# Altium schematic sheet PERIPHERAL.SchDoc: PERIPHERAL
size A3; Author: DODANHLUONG; Revision: 1.0; SheetNumber: 6; SheetTotal: 6; ProjectTitle: DSP_VERSION_1.0
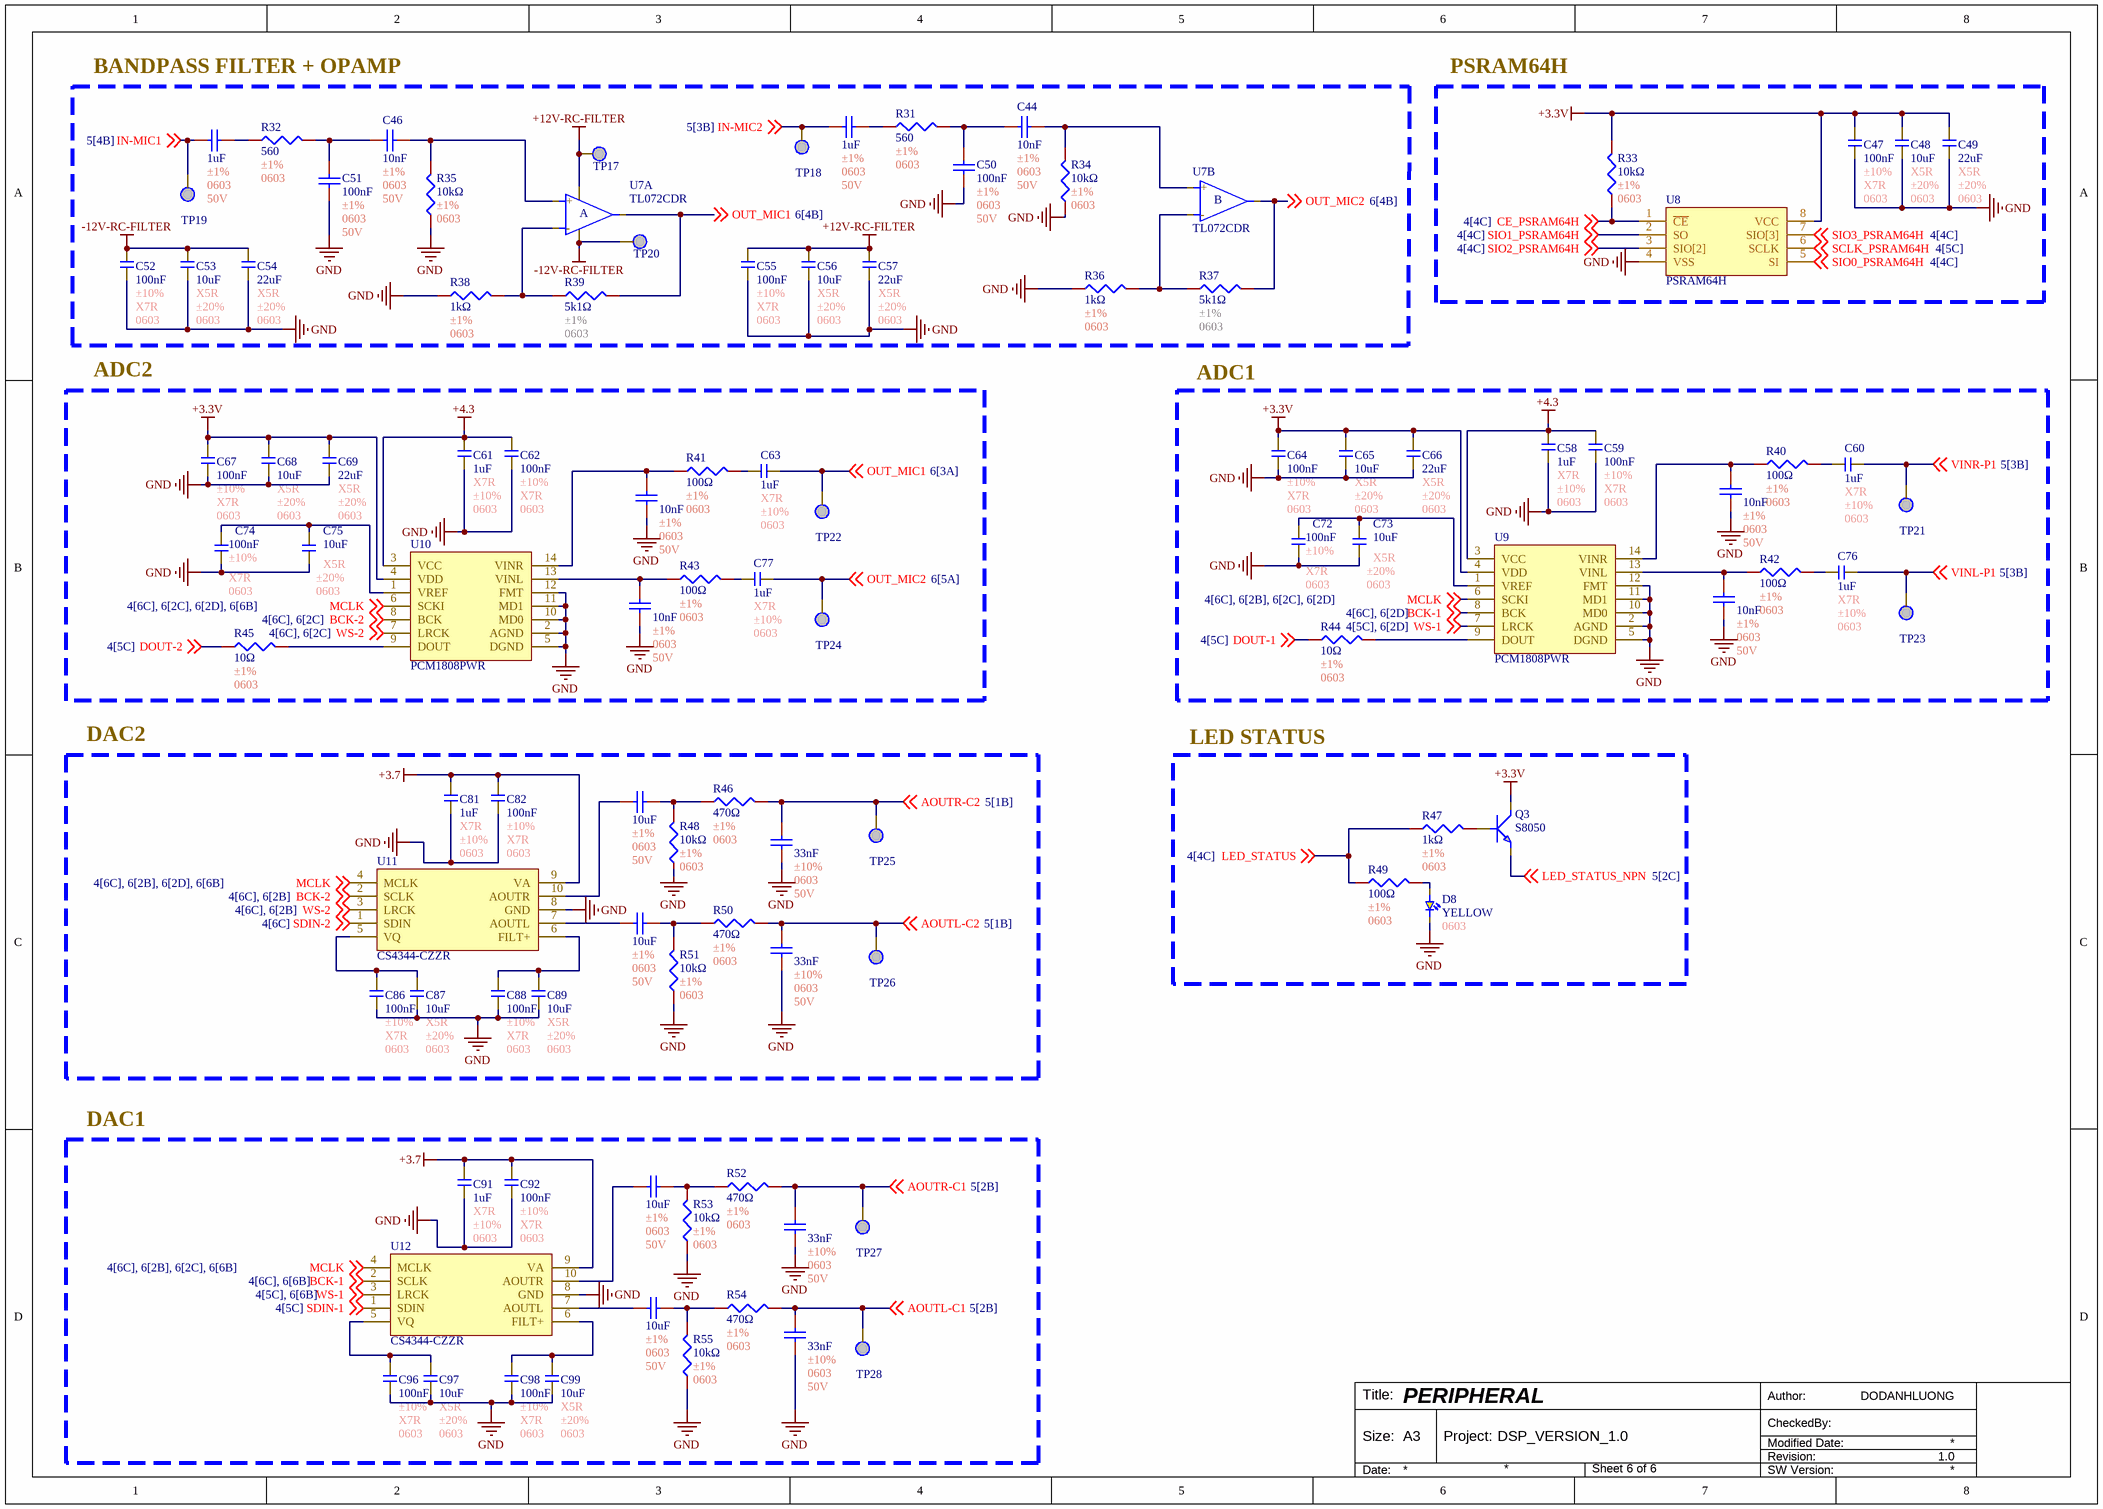
[diagram p0: PERIPHERAL.SchDoc]

## Parts
C43  1uF  Tolerance: ±1%  Package: 0603  Voltage Rating: 50V  [C0603]
C44  10nF  Tolerance: ±1%  Package: 0603  Voltage Rating: 50V  [C0603]
C45  1uF  Tolerance: ±1%  Package: 0603  Voltage Rating: 50V  [C0603]
C46  10nF  Tolerance: ±1%  Package: 0603  Voltage Rating: 50V  [C0603]
C47  100nF  Tolerance: ±10%  Temperature Coefficient: X7R  Package: 0603  [C0603]
C48  10uF  Temperature Coefficient: X5R  Tolerance: ±20%  Package: 0603  [C0603]
C49  22uF  Temperature Coefficient: X5R  Tolerance: ±20%  Package: 0603  [C0603]
C50  100nF  Tolerance: ±1%  Package: 0603  Voltage Rating: 50V  [C0603]
C51  100nF  Tolerance: ±1%  Package: 0603  Voltage Rating: 50V  [C0603]
C52  100nF  Tolerance: ±10%  Temperature Coefficient: X7R  Package: 0603  [C0603]
C53  10uF  Temperature Coefficient: X5R  Tolerance: ±20%  Package: 0603  [C0603]
C54  22uF  Temperature Coefficient: X5R  Tolerance: ±20%  Package: 0603  [C0603]
C55  100nF  Tolerance: ±10%  Temperature Coefficient: X7R  Package: 0603  [C0603]
C56  10uF  Temperature Coefficient: X5R  Tolerance: ±20%  Package: 0603  [C0603]
C57  22uF  Temperature Coefficient: X5R  Tolerance: ±20%  Package: 0603  [C0603]
C58  1uF  Temperature Coefficient: X7R  Tolerance: ±10%  Package: 0603  [C0603]
C59  100nF  Tolerance: ±10%  Temperature Coefficient: X7R  Package: 0603  [C0603]
C60  1uF  Temperature Coefficient: X7R  Tolerance: ±10%  Package: 0603  [C0603]
C61  1uF  Temperature Coefficient: X7R  Tolerance: ±10%  Package: 0603  [C0603]
C62  100nF  Tolerance: ±10%  Temperature Coefficient: X7R  Package: 0603  [C0603]
C63  1uF  Temperature Coefficient: X7R  Tolerance: ±10%  Package: 0603  [C0603]
C64  100nF  Tolerance: ±10%  Temperature Coefficient: X7R  Package: 0603  [C0603]
C65  10uF  Temperature Coefficient: X5R  Tolerance: ±20%  Package: 0603  [C0603]
C66  22uF  Temperature Coefficient: X5R  Tolerance: ±20%  Package: 0603  [C0603]
C67  100nF  Tolerance: ±10%  Temperature Coefficient: X7R  Package: 0603  [C0603]
C68  10uF  Temperature Coefficient: X5R  Tolerance: ±20%  Package: 0603  [C0603]
C69  22uF  Temperature Coefficient: X5R  Tolerance: ±20%  Package: 0603  [C0603]
C70  10nF  Tolerance: ±1%  Package: 0603  Voltage Rating: 50V  [C0603]
C71  10nF  Tolerance: ±1%  Package: 0603  Voltage Rating: 50V  [C0603]
C72  100nF  Tolerance: ±10%  Temperature Coefficient: X7R  Package: 0603  [C0603]
C73  10uF  Temperature Coefficient: X5R  Tolerance: ±20%  Package: 0603  [C0603]
C74  100nF  Tolerance: ±10%  Temperature Coefficient: X7R  Package: 0603  [C0603]
C75  10uF  Temperature Coefficient: X5R  Tolerance: ±20%  Package: 0603  [C0603]
C76  1uF  Temperature Coefficient: X7R  Tolerance: ±10%  Package: 0603  [C0603]
C77  1uF  Temperature Coefficient: X7R  Tolerance: ±10%  Package: 0603  [C0603]
C78  10nF  Tolerance: ±1%  Package: 0603  Voltage Rating: 50V  [C0603]
C79  10nF  Tolerance: ±1%  Package: 0603  Voltage Rating: 50V  [C0603]
C80  10uF  Tolerance: ±1%  Package: 0603  Voltage Rating: 50V  [C0603]
C81  1uF  Temperature Coefficient: X7R  Tolerance: ±10%  Package: 0603  [C0603]
C82  100nF  Tolerance: ±10%  Temperature Coefficient: X7R  Package: 0603  [C0603]
C83  33nF  Tolerance: ±10%  Package: 0603  Voltage Rating: 50V  [C0603]
C84  10uF  Tolerance: ±1%  Package: 0603  Voltage Rating: 50V  [C0603]
C85  33nF  Tolerance: ±10%  Package: 0603  Voltage Rating: 50V  [C0603]
C86  100nF  Tolerance: ±10%  Temperature Coefficient: X7R  Package: 0603  [C0603]
C87  10uF  Temperature Coefficient: X5R  Tolerance: ±20%  Package: 0603  [C0603]
C88  100nF  Tolerance: ±10%  Temperature Coefficient: X7R  Package: 0603  [C0603]
C89  10uF  Temperature Coefficient: X5R  Tolerance: ±20%  Package: 0603  [C0603]
C90  10uF  Tolerance: ±1%  Package: 0603  Voltage Rating: 50V  [C0603]
C91  1uF  Temperature Coefficient: X7R  Tolerance: ±10%  Package: 0603  [C0603]
C92  100nF  Tolerance: ±10%  Temperature Coefficient: X7R  Package: 0603  [C0603]
C93  33nF  Tolerance: ±10%  Package: 0603  Voltage Rating: 50V  [C0603]
C94  10uF  Tolerance: ±1%  Package: 0603  Voltage Rating: 50V  [C0603]
C95  33nF  Tolerance: ±10%  Package: 0603  Voltage Rating: 50V  [C0603]
C96  100nF  Tolerance: ±10%  Temperature Coefficient: X7R  Package: 0603  [C0603]
C97  10uF  Temperature Coefficient: X5R  Tolerance: ±20%  Package: 0603  [C0603]
C98  100nF  Tolerance: ±10%  Temperature Coefficient: X7R  Package: 0603  [C0603]
C99  10uF  Temperature Coefficient: X5R  Tolerance: ±20%  Package: 0603  [C0603]
D8  YELLOW  Package: 0603  [LED0603]
Q3  S8050  [S8050]
R31  560  Tolerance: ±1%  Package: 0603  [R0603]
R32  560  Tolerance: ±1%  Package: 0603  [R0603]
R33  10kΩ  Tolerance: ±1%  Package: 0603  [R0603]
R34  10kΩ  Tolerance: ±1%  Package: 0603  [R0603]
R35  10kΩ  Tolerance: ±1%  Package: 0603  [R0603]
R36  1kΩ  Tolerance: ±1%  Package: 0603  [R0603]
R37  5k1Ω  Tolerance: ±1%  Package: 0603  [R0603]
R38  1kΩ  Tolerance: ±1%  Package: 0603  [R0603]
R39  5k1Ω  Tolerance: ±1%  Package: 0603  [R0603]
R40  100Ω  Tolerance: ±1%  Package: 0603  [R0603]
R41  100Ω  Tolerance: ±1%  Package: 0603  [R0603]
R42  100Ω  Tolerance: ±1%  Package: 0603  [R0603]
R43  100Ω  Tolerance: ±1%  Package: 0603  [R0603]
R44  10Ω  Tolerance: ±1%  Package: 0603  [R0603]
R45  10Ω  Tolerance: ±1%  Package: 0603  [R0603]
R46  470Ω  Tolerance: ±1%  Package: 0603  [R0603]
R47  1kΩ  Tolerance: ±1%  Package: 0603  [R0603]
R48  10kΩ  Tolerance: ±1%  Package: 0603  [R0603]
R49  100Ω  Tolerance: ±1%  Package: 0603  [R0603]
R50  470Ω  Tolerance: ±1%  Package: 0603  [R0603]
R51  10kΩ  Tolerance: ±1%  Package: 0603  [R0603]
R52  470Ω  Tolerance: ±1%  Package: 0603  [R0603]
R53  10kΩ  Tolerance: ±1%  Package: 0603  [R0603]
R54  470Ω  Tolerance: ±1%  Package: 0603  [R0603]
R55  10kΩ  Tolerance: ±1%  Package: 0603  [R0603]
TP17  TP  [TP]  (value not drawn)
TP18  TP  [TP]  (value not drawn)
TP19  TP  [TP]  (value not drawn)
TP20  TP  [TP]  (value not drawn)
TP21  TP  [TP]  (value not drawn)
TP22  TP  [TP]  (value not drawn)
TP23  TP  [TP]  (value not drawn)
TP24  TP  [TP]  (value not drawn)
TP25  TP  [TP]  (value not drawn)
TP26  TP  [TP]  (value not drawn)
TP27  TP  [TP]  (value not drawn)
TP28  TP  [TP]  (value not drawn)
U7  TL072CDR  [TL072CDR]  (parts A,B of 2)
U8  PSRAM64H  [PSRAM64H]
U9  PCM1808PWR  [PCM1808PWR]
U10  PCM1808PWR  [PCM1808PWR]
U11  CS4344-CZZR  [CS4344-CZZR]
U12  CS4344-CZZR  [CS4344-CZZR]

## Blocks framed on the sheet
BANDPASS FILTER + OPAMP: C43-C46 C50-C57 R31 R32 R34-R39 TP17-TP20 U7
PSRAM64H: C47-C49 R33 U8
ADC2: C61-C63 C67-C69 C71 C74 C75 C77 C79 R41 R43 R45 TP22 TP24 U10
ADC1: C58-C60 C64-C66 C70 C72 C73 C76 C78 R40 R42 R44 TP21 TP23 U9
DAC2: C80-C89 R46 R48 R50 R51 TP25 TP26 U11
LED STATUS: D8 Q3 R47 R49
DAC1: C90-C99 R52-R55 TP27 TP28 U12

## Nets
+3.3V: C47.2 C48.2 C49.2 C64.2 C65.2 C66.2 C67.2 C68.2 C69.2 Q3.3(C) R33.2 U8.8(VCC) U9.4(VDD) U10.4(VDD)
+3.7: C81.2 C82.2 C91.2 C92.2 U11.9(VA) U12.9(VA)
+4.3: C58.2 C59.2 C61.2 C62.2 U9.3(VCC) U10.3(VCC)
+12V-RC-FILTER: C55.2 C56.2 C57.2 TP17.1 U7.8
-12V-RC-FILTER: C52.2 C53.2 C54.2 TP20.1 U7.4(GND)
GND: C47.1 C48.1 C49.1 C50.2 C51.2 C52.1 C53.1 C54.1 C55.1 C56.1 C57.1 C58.1 C59.1 C61.1 C62.1 C64.1 C65.1 C66.1 C67.1 C68.1 C69.1 C70.2 C71.2 C72.1 C73.1 C74.1 C75.1 C78.2 C79.2 C81.1 C82.1 C83.2 C85.2 C86.1 C87.1 C88.1 C89.1 C91.1 C92.1 C93.2 C95.2 C96.1 C97.1 C98.1 C99.1 D8.1 R34.1 R35.1 R36.1 R38.1 R48.1 R51.1 R53.1 R55.1 U8.4(VSS) U9.2(AGND) U9.5(DGND) U9.10(MD0) U9.11(MD1) U9.12(FMT) U10.2(AGND) U10.5(DGND) U10.10(MD0) U10.11(MD1) U10.12(FMT) U11.8(GND) U12.8(GND)
AOUTL-C1: C95.1 R54.2 TP28.1 ; off-sheet AOUTL-C1
AOUTL-C2: C85.1 R50.2 TP26.1 ; off-sheet AOUTL-C2
AOUTR-C1: C93.1 R52.2 TP27.1 ; off-sheet AOUTR-C1
AOUTR-C2: C83.1 R46.2 TP25.1 ; off-sheet AOUTR-C2
BCK-1: U9.8(BCK) U12.2(SCLK) ; off-sheet BCK-1
BCK-2: U10.8(BCK) U11.2(SCLK) ; off-sheet BCK-2
CE_PSRAM64H: R33.1 U8.1(~{CE}) ; off-sheet CE_PSRAM64H
DOUT-1: R44.1 ; off-sheet DOUT-1
DOUT-2: R45.1 ; off-sheet DOUT-2
IN-MIC1: C45.2 TP19.1 ; off-sheet IN-MIC1
IN-MIC2: C43.2 TP18.1 ; off-sheet IN-MIC2
LED_STATUS: R47.1 R49.1 ; off-sheet LED_STATUS
LED_STATUS_NPN: Q3.2(E) ; off-sheet LED_STATUS_NPN
MCLK: U9.6(SCKI) U10.6(SCKI) U11.4(MCLK) U12.4(MCLK) ; off-sheet MCLK
OUT_MIC1: C63.1 R39.2 TP22.1 U7.1(out) ; off-sheet OUT_MIC1
OUT_MIC2: C77.1 R37.2 TP24.1 U7.7(out) ; off-sheet OUT_MIC2
SCLK_PSRAM64H: U8.6(SCLK) ; off-sheet SCLK_PSRAM64H
SDIN-1: U12.1(SDIN) ; off-sheet SDIN-1
SDIN-2: U11.1(SDIN) ; off-sheet SDIN-2
SIO0_PSRAM64H: U8.5(SI) ; off-sheet SIO0_PSRAM64H
SIO1_PSRAM64H: U8.2(SO) ; off-sheet SIO1_PSRAM64H
SIO2_PSRAM64H: U8.3(SIO[2]) ; off-sheet SIO2_PSRAM64H
SIO3_PSRAM64H: U8.7(SIO[3]) ; off-sheet SIO3_PSRAM64H
VINL-P1: C76.1 TP23.1 ; off-sheet VINL-P1
VINR-P1: C60.1 TP21.1 ; off-sheet VINR-P1
WS-1: U9.7(LRCK) U12.3(LRCK) ; off-sheet WS-1
WS-2: U10.7(LRCK) U11.3(LRCK) ; off-sheet WS-2
NetC43_1: C43.1 R31.1
NetC44_1: C44.1 C50.1 R31.2
NetC44_2: C44.2 R34.2 U7.5(+)
NetC45_1: C45.1 R32.1
NetC46_1: C46.1 C51.1 R32.2
NetC46_2: C46.2 R35.2 U7.3(+)
NetC60_2: C60.2 R40.2
NetC63_2: C63.2 R41.2
NetC70_1: C70.1 R40.1 U9.14(VINR)
NetC71_1: C71.1 R41.1 U10.14(VINR)
NetC72_2: C72.2 C73.2 U9.1(VREF)
NetC74_2: C74.2 C75.2 U10.1(VREF)
NetC76_2: C76.2 R42.2
NetC77_2: C77.2 R43.2
NetC78_1: C78.1 R42.1 U9.13(VINL)
NetC79_1: C79.1 R43.1 U10.13(VINL)
NetC80_1: C80.1 R46.1 R48.2
NetC80_2: C80.2 U11.10(AOUTR)
NetC84_1: C84.1 R50.1 R51.2
NetC84_2: C84.2 U11.7(AOUTL)
NetC86_2: C86.2 C87.2 U11.5(VQ)
NetC88_2: C88.2 C89.2 U11.6(FILT+)
NetC90_1: C90.1 R52.1 R53.2
NetC90_2: C90.2 U12.10(AOUTR)
NetC94_1: C94.1 R54.1 R55.2
NetC94_2: C94.2 U12.7(AOUTL)
NetC96_2: C96.2 C97.2 U12.5(VQ)
NetC98_2: C98.2 C99.2 U12.6(FILT+)
NetD8_2: D8.2 R49.2
NetQ3_1: Q3.1(B) R47.2
NetR36_2: R36.2 R37.1 U7.6(-)
NetR38_2: R38.2 R39.1 U7.2(-)
NetR44_2: R44.2 U9.9(DOUT)
NetR45_2: R45.2 U10.9(DOUT)

## Notes on the sheet
- Author:
- Title:
- Size:
- A3
- Project:
- Revision:
- Modified Date:
- CheckedBy:
- Date:
- SW Version:
- (in symbol TL072CDR, part A) A
- (in symbol TL072CDR, part B) B

## Library data of the parts
C43 C45 = C0603_1uF_±1%: 50V 10pF NP0 ±1% 0402 Multilayer Ceramic Capacitors MLCC - SMD/SMT ROHS; Manufacturer: YAGEO; Mfr. Part #: CC0402FRNPO9BN100; LCSC Part #: C513681; Link: https://www.lcsc.com/product-detail/C513681.html?s_z=n_capital%2520yageo%252010pF%25200402; Capacitance: 1uF
C44 C46 C70 C71 C78 C79 = C0603_10nF_±1%: 50V 10pF NP0 ±1% 0402 Multilayer Ceramic Capacitors MLCC - SMD/SMT ROHS; Manufacturer: YAGEO; Mfr. Part #: CC0402FRNPO9BN100; LCSC Part #: C513681; Link: https://www.lcsc.com/product-detail/C513681.html?s_z=n_capital%2520yageo%252010pF%25200402; Capacitance: 10nF
C47 C52 C55 C59 C62 C64 C67 C72 C74 C82 C86 C88 C92 C96 C98 = C0603_100nF_±10%_X7R: 50V 100nF X7R ±10% 0603 Multilayer Ceramic Capacitors MLCC - SMD/SMT ROHS; Manufacturer: YAGEO; Mfr. Part #: CC0603KRX7R9BB104; LCSC Part #: C14663; Capacitance: 100nF; Link: https://www.lcsc.com/product-detail/C14663.html?s_z=n_capital%25200603%2520100nf
C48 C53 C56 C65 C68 C73 C75 C87 C89 C97 C99 = C0603_10uF_±10%_X7R: 25V 10uF X5R ±20% 0603 Multilayer Ceramic Capacitors MLCC - SMD/SMT ROHS; Manufacturer: YAGEO; Mfr. Part #: CC0603MRX5R8BB106; LCSC Part #: C596327; Capacitance: 10uF; Link: https://www.lcsc.com/product-detail/C596327.html?s_z=n_capital%25200603%252010uF%2520yageo
C49 C54 C57 C66 C69 = C0603_22uF_±20%_X5R: 6.3V 22uF X5R ±20% 0603 Multilayer Ceramic Capacitors MLCC - SMD/SMT ROHS; Manufacturer: YAGEO; Mfr. Part #: CC0603MRX5R5BB226; LCSC Part #: C109448; ComponentLink1Description: New link; ComponentLink1URL: *; Capacitance: 22uF; Link: https://www.lcsc.com/product-detail/C109448.html?s_z=n_capital%25200603%252022uf%2520yageo
C50 C51 = C0603_10nF_±1%: 50V 10pF NP0 ±1% 0402 Multilayer Ceramic Capacitors MLCC - SMD/SMT ROHS; Manufacturer: YAGEO; Mfr. Part #: CC0402FRNPO9BN100; Capacitance: 10nF; LCSC Part #: C513681; Link: https://www.lcsc.com/product-detail/C513681.html?s_z=n_capital%2520yageo%252010pF%25200402
C58 C60 C61 C63 C76 C77 C81 C91 = C0603_1uF_±10%_X7R: 50V 1uF X7R ±10% 0603 Multilayer Ceramic Capacitors MLCC - SMD/SMT ROHS; Manufacturer: YAGEO; Mfr. Part #: CC0603KRX7R9BB105; LCSC Part #: C559769; Capacitance: 1uF; Link: https://www.lcsc.com/product-detail/C559769.html?s_z=n_capital%25200603%25201uF%2520yageo
C80 C84 C90 C94 = C0603_10uF_±1%: 50V 10pF NP0 ±1% 0402 Multilayer Ceramic Capacitors MLCC - SMD/SMT ROHS; Manufacturer: YAGEO; Mfr. Part #: CC0402FRNPO9BN100; LCSC Part #: C513681; Link: https://www.lcsc.com/product-detail/C513681.html?s_z=n_capital%2520yageo%252010pF%25200402; Capacitance: 10uF
C83 C85 C93 C95 = C0603_33nF_±10%: 100mW Thick Film Resistor 75V ±100ppm/℃ ±1% 470Ω 0603 Chip Resistor - Surface Mount ROHS; Manufacturer: YAGEO; Mfr. Part #: CC0603KRX7R9BB333; Temperature Coefficient: X7R; LCSC Part #: C106856; Link: https://www.lcsc.com/product-detail/C106856.html?s_z=n_capital%2520yageo%25200603%252033nF; Capacitance: 33nF
D8 = D0603_YELLOW: 25mcd~40mcd Water Clear -40℃~+85℃ 624nm Red 120° 60mW 0402 LED Indication - Discrete ROHS; Manufacturer: XINGLIGHT; Mfr. Part #: XL-1005UGC; Voltage - Forward(Vf): 3V; LCSC Part #: C965793; Power(Watts): 60mW; Link: https://www.lcsc.com/product-detail/C136765.html?s_z=n_LED%25200402%2520RED; Illumination Color: YELLOW
Q3 = S8050: 25V 300mW 500mA SOT-23 Bipolar (BJT) ROHS; Manufacturer: JSMSEMI; Key Attributes: TRANS 25V 500mA SOT-23; Transition frequency(fT): 150MHz; Vce Saturation(VCE(sat)): 600mV; Mfr. Part #: S8050; LCSC Part #: C916390; Package: SOT-23; Link: https://www.lcsc.com/product-detail/C916390.html?s_z=n_s8050; Current - Collector(Ic): 500mA
R31 R32 = R0603_1kΩ_±1%: 62.5mW Thick Film Resistor 50V ±1% ±200ppm/℃ 10Ω 0402 Chip Resistor - Surface Mount ROHS; Manufacturer: YAGEO; Mfr. Part #: RC0402FR-0710RL; Resistance: 1kΩ; LCSC Part #: C138066; Link: https://www.lcsc.com/product-detail/C138066.html?s_z=n_resistor%25200402%252010R
R33-R35 R48 R51 R53 R55 = R0603_10kΩ_±1%: 62.5mW Thick Film Resistor 50V ±1% ±200ppm/℃ 10Ω 0402 Chip Resistor - Surface Mount ROHS; Manufacturer: YAGEO; Mfr. Part #: RC0402FR-0710RL; LCSC Part #: C138066; Resistance: 10kΩ; Link: https://www.lcsc.com/product-detail/C138066.html?s_z=n_resistor%25200402%252010R
R36 R38 R47 = R0603_1kΩ_±1%: 62.5mW Thick Film Resistor 50V ±1% ±200ppm/℃ 10Ω 0402 Chip Resistor - Surface Mount ROHS; Manufacturer: YAGEO; Mfr. Part #: RC0402FR-0710RL; LCSC Part #: C138066; Resistance: 1kΩ; Link: https://www.lcsc.com/product-detail/C138066.html?s_z=n_resistor%25200402%252010R
R37 R39 = R0603_5k1Ω_±1%: 100mW Thick Film Resistor 75V ±100ppm/℃ ±1% 5.1kΩ 0603 Chip Resistor - Surface Mount ROHS; Manufacturer: FOJAN; Mfr. Part #: FRC0603F5101TS; Key Attributes: RES 5.1kΩ ±1% 100mW 0603; LCSC Part #: C2907044; Link: https://www.lcsc.com/product-detail/C2907044.html?s_z=n_5k1%25200603; Resistance: 5k1Ω
R40-R43 R49 = R0603_100Ω_±1%: 62.5mW Thick Film Resistor 50V ±1% ±200ppm/℃ 10Ω 0402 Chip Resistor - Surface Mount ROHS; Manufacturer: YAGEO; Mfr. Part #: RC0402FR-0710RL; LCSC Part #: C138066; Resistance: 100Ω; Link: https://www.lcsc.com/product-detail/C138066.html?s_z=n_resistor%25200402%252010R
R44 R45 = R0603_10Ω_±1%: 62.5mW Thick Film Resistor 50V ±1% ±200ppm/℃ 10Ω 0402 Chip Resistor - Surface Mount ROHS; Manufacturer: YAGEO; Mfr. Part #: RC0402FR-0710RL; LCSC Part #: C138066; Resistance: 10Ω; Link: https://www.lcsc.com/product-detail/C138066.html?s_z=n_resistor%25200402%252010R
R46 R50 R52 R54 = R0603_470Ω_±1%_1: 62.5mW Thick Film Resistor 50V ±1% ±200ppm/℃ 10Ω 0402 Chip Resistor - Surface Mount ROHS; Manufacturer: YAGEO; Mfr. Part #: RC0603FR-07470RL; Key Attributes: RES 470Ω ±1% 100mW 0603; LCSC Part #: C114669; Resistance: 470Ω; Link: https://www.lcsc.com/product-detail/C114669.html?s_z=n_resistor%2520470%25CE%25A9%25200603%2520yageo
U7 = TL072CDR: 3mV 65pA 3MHz 13V/us 2 SOIC-8 FET Input Amplifiers ROHS; Manufacturer: TI; Noise density(eN): 18nV/√Hz@1kHz; Dual Supply: -15V~15V; Number of Channels: 2; LCSC Part #: C67473; Package: SOIC-8; Gain Bandwidth Product: 3MHz; Link: https://www.lcsc.com/product-detail/C67473.html?s_z=n_TL072CDR; Mfr. Part #: TL072CDR
U9 U10 = PCM1808PWR: 4.5V~5.5V 24 I2S TSSOP-14 ADCs/DACs - Special Purpose ROHS; Manufacturer: TI; Key Attributes: Single-ended analog input 24-bit 96kHz stereo A/D converter; Number of Channels: 2; Mfr. Part #: PCM1808PWR; LCSC Part #: C55513; Package: TSSOP-14; Voltage - Supply: 4.5V~5.5V; Interface: I2S; Link: https://www.lcsc.com/product-detail/C55513.html?s_z=n_pcm1808
U11 U12 = CS4344-CZZR: 250ms I2S 3.3V~5V 24 TSSOP-10-3mm Digital to Analog Converters (DAC) ROHS; Manufacturer: Cirrus Logic; Key Attributes: 10-Pin, 24-Bit, 192 kHz Stereo D/A Converter; Number of Channels: 2; Mfr. Part #: CS4344-CZZR; LCSC Part #: C8952; Package: TSSOP-10-3mm; Link: https://www.lcsc.com/product-detail/C8952.html?s_z=n_cs4344; Voltage - Supply: 3.3V~5V; Interface: I2S